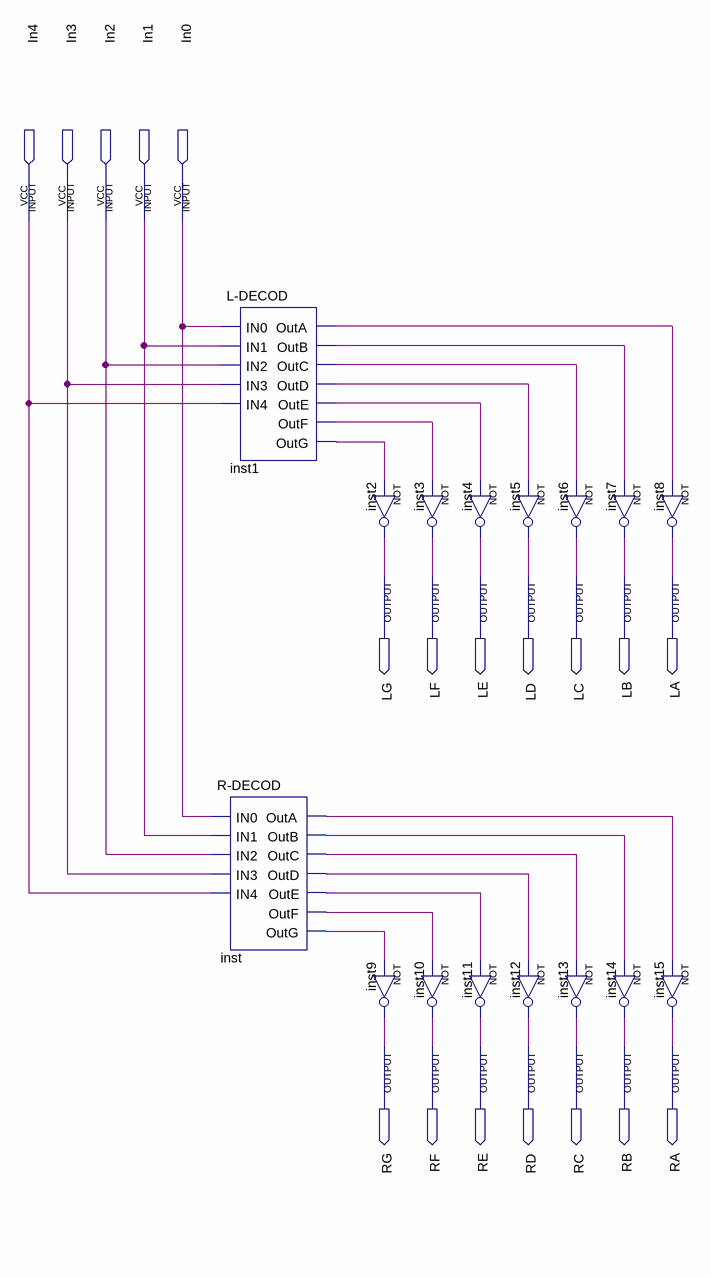
[diagram p0: schematic sheet]
// Quartus schematic Decoder.bdf as structural Verilog: 16 symbols, 19 pins
module Decoder (
  input  In4,
  input  In3,
  input  In2,
  input  In1,
  input  In0,
  output LG,
  output LF,
  output LE,
  output LD,
  output LC,
  output LB,
  output LA,
  output RG,
  output RF,
  output RE,
  output RD,
  output RC,
  output RB,
  output RA
);

  wire inst1_outa, inst1_outb, inst1_outc, inst1_outd, inst1_oute, inst1_outf, inst1_outg, inst_outa,
       inst_outb, inst_outc, inst_outd, inst_oute, inst_outf, inst_outg;

  \L-DECOD  inst1 (
    .IN0(In0), .IN1(In1), .IN2(In2), .IN3(In3), .IN4(In4), .OutA(inst1_outa), .OutB(inst1_outb),
    .OutC(inst1_outc), .OutD(inst1_outd), .OutE(inst1_oute), .OutF(inst1_outf), .OutG(inst1_outg));
  \R-DECOD  inst (
    .IN0(In0), .IN1(In1), .IN2(In2), .IN3(In3), .IN4(In4), .OutA(inst_outa), .OutB(inst_outb),
    .OutC(inst_outc), .OutD(inst_outd), .OutE(inst_oute), .OutF(inst_outf), .OutG(inst_outg));
  not inst2 (LG, inst1_outg);
  not inst9 (RG, inst_outg);
  not inst3 (LF, inst1_outf);
  not inst10 (RF, inst_outf);
  not inst4 (LE, inst1_oute);
  not inst5 (LD, inst1_outd);
  not inst11 (RE, inst_oute);
  not inst12 (RD, inst_outd);
  not inst6 (LC, inst1_outc);
  not inst7 (LB, inst1_outb);
  not inst13 (RC, inst_outc);
  not inst14 (RB, inst_outb);
  not inst8 (LA, inst1_outa);
  not inst15 (RA, inst_outa);
endmodule
